# Altium schematic sheet 09.ECAT_IN_OUT.SchDoc
size 297 x 209 mm
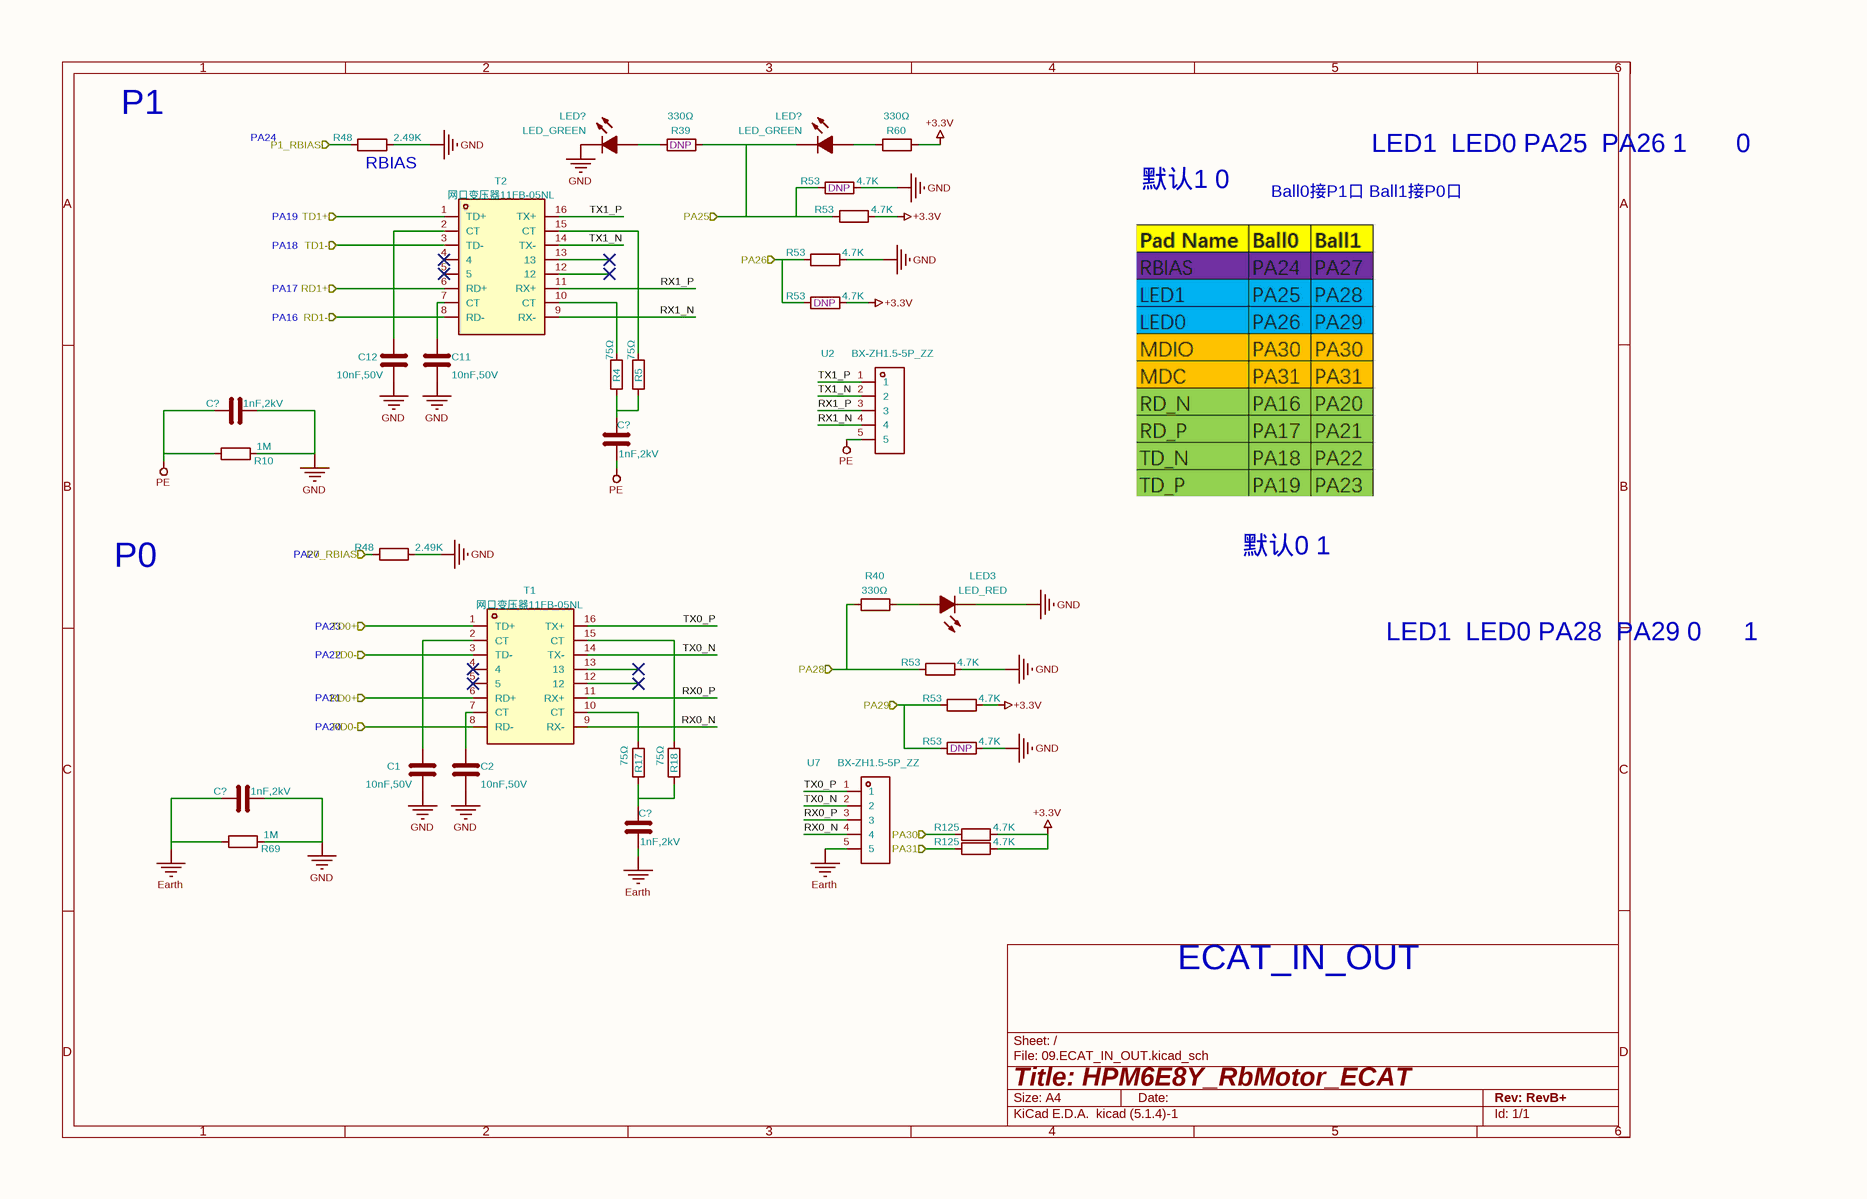
[diagram p0: 09.ECAT_IN_OUT.SchDoc]

## Parts
(Parts that share a designator on the sheet are numbered #1, #2 ... from top to bottom, then left to right.)
C1  10nF,50V  [C_0402]
C2  10nF,50V  [C_0402]
C11  10nF,50V  [C_0402]
C12  10nF,50V  [C_0402]
C?#1  1nF,2kV  [C_1206_3216Metric]
C?#2  1nF,2kV  [C_1206_3216Metric]
C?#3  1nF,2kV  [C_1206_3216Metric]
C?#4  1nF,2kV  [C_1206_3216Metric]
LED3  LED_RED  [LED_0603]
LED?#1  LED_GREEN  [LED_0603]
LED?#2  LED_GREEN  [LED_0603]
R4  75Ω  [R_0805_2012Metric]
R5  75Ω  [R_0805_2012Metric]
R10  1M  [R_1206_3216Metric]
R17  75Ω  [R_0805_2012Metric]
R18  75Ω  [R_0805_2012Metric]
R39  ASSY_OPT: DNP  [R_0402_1005Metric]  (hidden comment: 330Ω)
R40  330Ω  [R_0402_1005Metric]
R48#1  2.49K  [R_0402_1005Metric]
R48#2  2.49K  [R_0402_1005Metric]
R53#1  ASSY_OPT: DNP  [R_0402_1005Metric]  (hidden comment: 4.7K)
R53#2  4.7K  [R_0402_1005Metric]
R53#3  4.7K  [R_0402_1005Metric]
R53#4  ASSY_OPT: DNP  [R_0402_1005Metric]  (hidden comment: 4.7K)
R53#5  4.7K  [R_0402_1005Metric]
R53#6  4.7K  [R_0402_1005Metric]
R53#7  ASSY_OPT: DNP  [R_0402_1005Metric]  (hidden comment: 4.7K)
R60  330Ω  [R_0402_1005Metric]
R69  1M  [R_1206_3216Metric]
R125#1  4.7K  [R_0402_1005Metric]
R125#2  4.7K  [R_0402_1005Metric]
T1  网口变压器11FB-05NL  [H1102_XFMR16_SM]
T2  网口变压器11FB-05NL  [H1102_XFMR16_SM]
U2  BX-ZH1.5-5P_ZZ  [CONN-TH_ZH1.5-5A]
U7  BX-ZH1.5-5P_ZZ  [CONN-TH_ZH1.5-5A]

## Ports
P0_RBIAS (in), P1_RBIAS (in), PA25 (in), PA26 (in), PA28 (in), PA29 (in), PA30 (in), PA31 (in), RD0+ (in), RD0- (in), RD1+ (in), RD1- (in), TD0+ (in), TD0- (in), TD1+ (in), TD1- (in)

## Nets
+3.3V: R53#2.2 R53#4.2 R53#6.2 R60.2 R125#1.2 R125#2.2
Earth: C?#3.1 C?#4.2 R69.1 U7.5
GND: C1.1 C2.1 C11.1 C12.1 C?#1.2 C?#3.2 LED3.1(K) LED?#1.1(K) R10.2 R48#1.2 R48#2.2 R53#1.2 R53#3.2 R53#5.2 R53#7.2 R69.2
PE: C?#1.1 C?#2.2 R10.1 U2.5
P0_RBIAS: R48#2.1 ; port P0_RBIAS
P1_RBIAS: R48#1.1 ; port P1_RBIAS
PA25: LED?#2.1(K) R39.2 R53#1.1 R53#2.1 ; port PA25
PA26: R53#3.1 R53#4.1 ; port PA26
PA28: R40.2 R53#5.1 ; port PA28
PA29: R53#6.1 R53#7.1 ; port PA29
PA30: R125#1.1 ; port PA30
PA31: R125#2.1 ; port PA31
RD0+: T1.6(RD+) ; port RD0+
RD0-: T1.8(RD-) ; port RD0-
RD1+: T2.6(RD+) ; port RD1+
RD1-: T2.8(RD-) ; port RD1-
RX0_N: T1.9(RX-) U7.4
RX0_P: T1.11(RX+) U7.3
RX1_N: T2.9(RX-) U2.4
RX1_P: T2.11(RX+) U2.3
TD0+: T1.1(TD+) ; port TD0+
TD0-: T1.3(TD-) ; port TD0-
TD1+: T2.1(TD+) ; port TD1+
TD1-: T2.3(TD-) ; port TD1-
TX0_N: T1.14(TX-) U7.2
TX0_P: T1.16(TX+) U7.1
TX1_N: T2.14(TX-) U2.2
TX1_P: T2.16(TX+) U2.1
NetC1_2: C1.2 T1.2(CT)
NetC2_2: C2.2 T1.7(CT)
NetC11_2: C11.2 T2.7(CT)
NetC12_2: C12.2 T2.2(CT)
NetC?#2_1: C?#2.1 R4.1 R5.1
NetC?#4_1: C?#4.1 R17.1 R18.1
NetLED3_2: LED3.2(A) R40.1
NetLED?#1_2: LED?#1.2(A) R39.1
NetLED?#2_2: LED?#2.2(A) R60.1
NetR4_2: R4.2 T2.10(CT)
NetR5_2: R5.2 T2.15(CT)
NetR17_2: R17.2 T1.10(CT)
NetR18_2: R18.2 T1.15(CT)

Not connected (* = marked no-connect by the designer): T1 4* 5* 12* 13*; T2 4* 5* 12* 13*

## Notes on the sheet
- P1
- PA24
- PA19
- (near R48#1) RBIAS
- 默认1 0
- Ball0接P1口
  Ball1接P0口
- LED1  LED0
  PA25  PA26
  1       0
- PA18
- PA17
- PA16
- P0
- PA27
- 默认0 1
- PA23
- LED1  LED0
  PA28  PA29
  0      1
- PA21
- PA22
- PA20
- ECAT_IN_OUT
- 1
- 2
- 3
- 4
- 5
- 6
- A
- B
- C
- D
- Title: HPM6E8Y_RbMotor_ECAT
- File: 09.ECAT_IN_OUT.kicad_sch
- Sheet: /
- KiCad E.D.A.  kicad (5.1.4)-1
- Size: A4
- Date:
- Rev: RevB+
- Id: 1/1

## Library data of the parts
C1 C2 C11 C12 = 10nF,50V: Model: CL05B103KB5NNNC; Company: SAMSUNG(三星); Value: 10nF,50V; Footprint: 03_HPM_Capacitance:C_0402
C?#1-C?#4 = 1nF,2kV_1206: Model: CC1206KKX7RDBB102; Company: YAGEO(国巨); Value: 1nF,2kV; Footprint: 03_HPM_Capacitance:C_1206_3216Metric
LED3 = LED_RED: Model: NCD0603R1; Company: 国星光电; Value: LED_RED; Footprint: 01_HPM_Peripheral:LED_0603
LED?#1 LED?#2 = LED_GREEN: Model: NCD0603C1; Company: 国星光电; Value: LED_GREEN; Footprint: 01_HPM_Peripheral:LED_0603
R4 R5 R17 R18 = 75Ω_0805: Model: 0805W8F750JT5E; Company: UNI-ROYAL(厚声); Value: 75Ω; Footprint: 02_HPM_Resistor:R_0805_2012Metric
R10 R69 = 1M_1206: Model: ARG06BTC1004; Company: Viking(光颉); Value: 1M; Footprint: 02_HPM_Resistor:R_1206_3216Metric
R39 R40 R60 = 330Ω_0402: Model: 0402WGF3300TCE; Company: UNI-ROYAL(厚声); Value: 330Ω; Footprint: 02_HPM_Resistor:R_0402_1005Metric
R48#1 R48#2 = 2.49K_0402: Model: RC-02W2491FT; Company: FH(风华); Value: 2.49K; Footprint: 02_HPM_Resistor:R_0402_1005Metric
R53#1-R53#7 R125#1 R125#2 = 4.7K_0402: Model: 0402WGF4701TCE; Company: UNI-ROYAL(厚声); Value: 4.7K; Footprint: 02_HPM_Resistor:R_0402_1005Metric
T1 T2 = 网口变压器11FB-05NL: Company: YDS(元册科技); Model: 11FB-05NL; Value: 网口变压器11FB-05NL
U2 U7 = BX-ZH1.5-5P_ZZ: Model: BX-ZH1.5-5PZZ; Company: Bossie(博锡); Value: BX-ZH1.5-5P_ZZ; Footprint: 13_ower:CONN-TH_ZH1.5-5A